# Altium schematic sheet AFE.SchDoc: AFE
size A4; Author: Samuel López; DrawnBy: Samuel López; DocumentNumber: 2; SheetNumber: 2; SheetTotal: 6
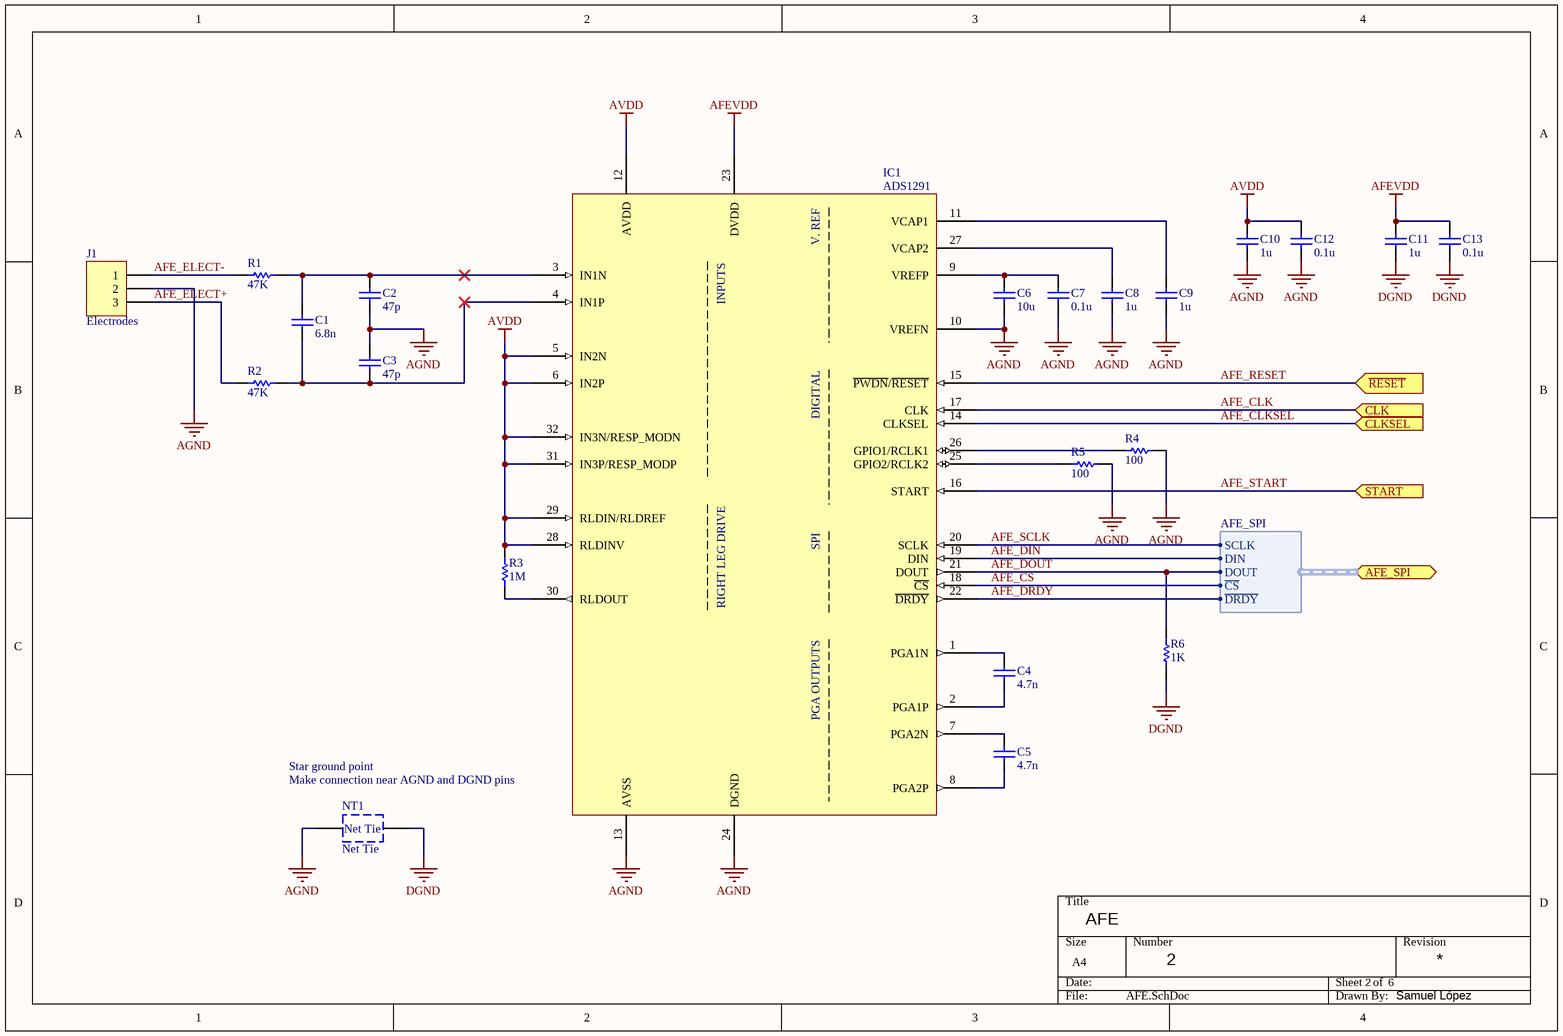
[diagram p0: AFE.SchDoc]

## Parts
C1  6.8n  [C0603]
C2  47p  [C0603]
C3  47p  [C0603]
C4  4.7n  [C0603]
C5  4.7n  [C0603]
C6  10u  [C0603]
C7  0.1u  [C0603]
C8  1u  [C0603]
C9  1u  [C0603]
C10  1u  [C0603]
C11  1u  [C0603]
C12  0.1u  [C0603]
C13  0.1u  [C0603]
IC1  ADS1291  [TSQFP50P700X700X120-32N]
J1  Electrodes  [JST PH 3 Socket]
NT1  Net Tie  [Net Tie (AGND-DGND)]  (net tie, no BOM)
R1  47K  [R0603]
R2  47K  [R0603]
R3  1M  [R0603]
R4  100  [R0603]
R5  100  [R0603]
R6  1K  [R0603]

## Ports
AFE_SPI (harness AFE_SPI), CLK (in), CLKSEL (in), START (in), ~{RESET} (in)

## Harnesses
AFE_SPI: SCLK, DIN, DOUT, ~{CS}, ~{DRDY}

## Nets
AFEVDD: C11.2 C13.2 IC1.23(DVDD)
AGND: C2.1 C3.2 C6.1 C7.1 C8.1 C9.1 C10.1 C12.1 IC1.10(VREFN) IC1.13(AVSS) IC1.24(DGND) J1.2 NT1.1 R4.2 R5.2
AVDD: C10.2 C12.2 IC1.5(IN2N) IC1.6(IN2P) IC1.12(AVDD) IC1.28(RLDINV) IC1.29(RLDIN/RLDREF) IC1.31(IN3P/RESP_MODP) IC1.32(IN3N/RESP_MODN) R3.2
DGND: C11.1 C13.1 NT1.2 R6.1
AFE_CLK: IC1.17(CLK) ; port CLK
AFE_CLKSEL: IC1.14(CLKSEL) ; port CLKSEL
AFE_CS: IC1.18(~{CS}) ; port AFE_SPI.~{CS}
AFE_DIN: IC1.19(DIN) ; port AFE_SPI.DIN
AFE_DOUT: IC1.21(DOUT) R6.2 ; port AFE_SPI.DOUT
AFE_DRDY: IC1.22(~{DRDY}) ; port AFE_SPI.~{DRDY}
AFE_ELECT+: J1.3 R2.1
AFE_ELECT-: J1.1 R1.1
AFE_RESET: IC1.15(~{PWDN}/~{RESET}) ; port ~{RESET}
AFE_SCLK: IC1.20(SCLK) ; port AFE_SPI.SCLK
AFE_START: IC1.16(START) ; port START
NetC1_1: C1.1 C3.1 IC1.4(IN1P) R2.2
NetC1_2: C1.2 C2.2 IC1.3(IN1N) R1.2
NetC4_1: C4.1 IC1.2(PGA1P)
NetC4_2: C4.2 IC1.1(PGA1N)
NetC5_1: C5.1 IC1.8(PGA2P)
NetC5_2: C5.2 IC1.7(PGA2N)
NetC6_2: C6.2 C7.2 IC1.9(VREFP)
NetC8_2: C8.2 IC1.27(VCAP2)
NetC9_2: C9.2 IC1.11(VCAP1)
NetIC1_25: IC1.25(GPIO2/RCLK2) R5.1
NetIC1_26: IC1.26(GPIO1/RCLK1) R4.1
NetIC1_30: IC1.30(RLDOUT) R3.1

## Notes on the sheet
- Star ground point
- Make connection near AGND and DGND pins
- (in symbol ADS1291) V. REF; INPUTS; DIGITAL; RIGHT LEG DRIVE; SPI; PGA OUTPUTS

## Library data of the parts
C1-C13 = Capacitor: Rated Voltage: *
  C1: Value: 6.8n
  C2 C3: Value: 47p
  C4 C5: Value: 4.7n
  C6: Value: 10u
  C7 C12 C13: Value: 0.1u
  C8-C11: Value: 1u
J1 = JST PH 3 Pin Socket: Supplier 1: Digi-Key; Supplier Part Number 1: 455-1720-ND
NT1 = Net Tie: Net Tie (AGND-DGND)
R1-R6 = Resistor: Power: *
  R1 R2: Value: 47K
  R3: Value: 1M
  R4 R5: Value: 100
  R6: Value: 1K
IC1 = ADS1291: Supplier 1: Digi-Key; Supplier Part Number 1: 296-36547-5-ND